# Altium schematic sheet MS5611.SchDoc
size A4
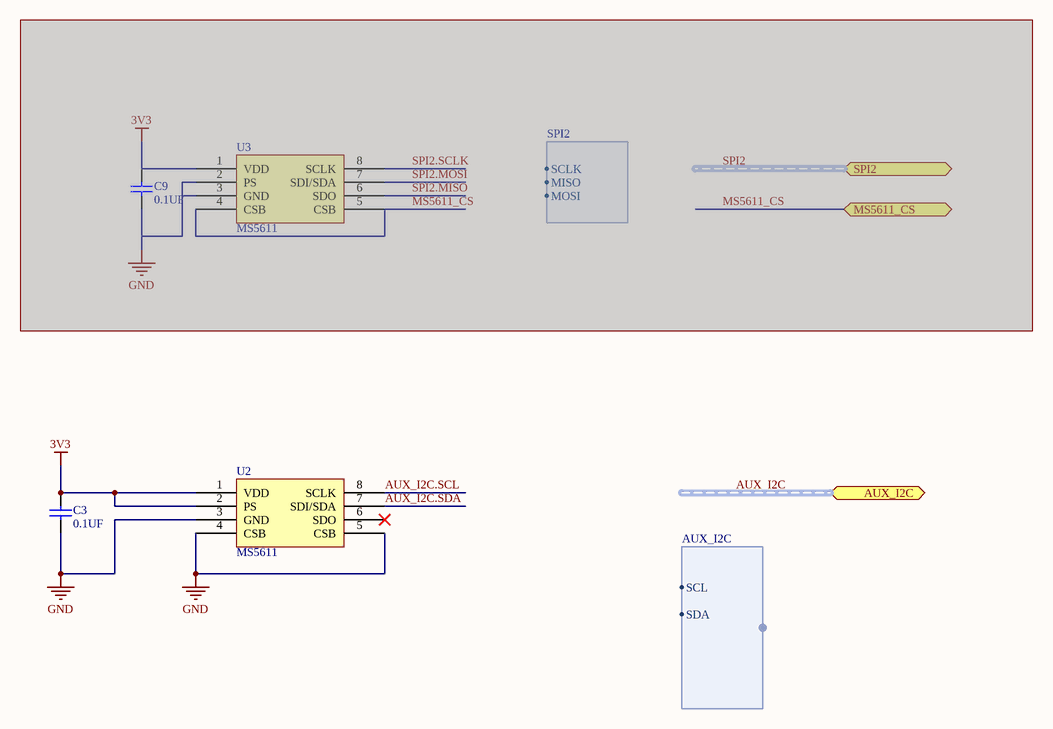
[diagram p0: MS5611.SchDoc]

## Parts
C3  value 0.1UF  [CAP_0603]  (hidden comment: Cap)
C9  value 0.1UF  [CAP_0603]  (hidden comment: Cap)  (masked out: inside a compile mask, not in the netlist)
U2  MS5611  [MS5611]
U3  MS5611  (masked out: inside a compile mask, not in the netlist)

## Ports
AUX_I2C (harness AUX_I2C), MS5611_CS, SPI2 (harness SPI2)

## Harnesses
SPI2: SCLK, MISO, MOSI
AUX_I2C: SCL, SDA

## Nets
3V3: C3.2 U2.1(VDD) U2.2(PS)
GND: C3.1 U2.3(GND) U2.4(CSB) U2.5(CSB)
AUX_I2C.SCL: U2.8(SCLK)
AUX_I2C.SDA: U2.7(SDI/SDA)

Not connected (* = marked no-connect by the designer): U2 6(SDO)*

## Buses and harness runs
harness AUX_I2C = port AUX_I2C

## Library data of the parts
C3 C9 = Cap: Capacitor; Published: 8-Jun-2000; LatestRevisionDate: 17-Jul-2002; LatestRevisionNote: Re-released for DXP Platform.; PackageReference: RAD-0.3; Publisher: Altium Limited; PackageDescription: Radial Cap, Thru-Hole; 2 Leads; 0.3 in Pin Spacing